# Altium schematic sheet MCU.SchDoc
size A4
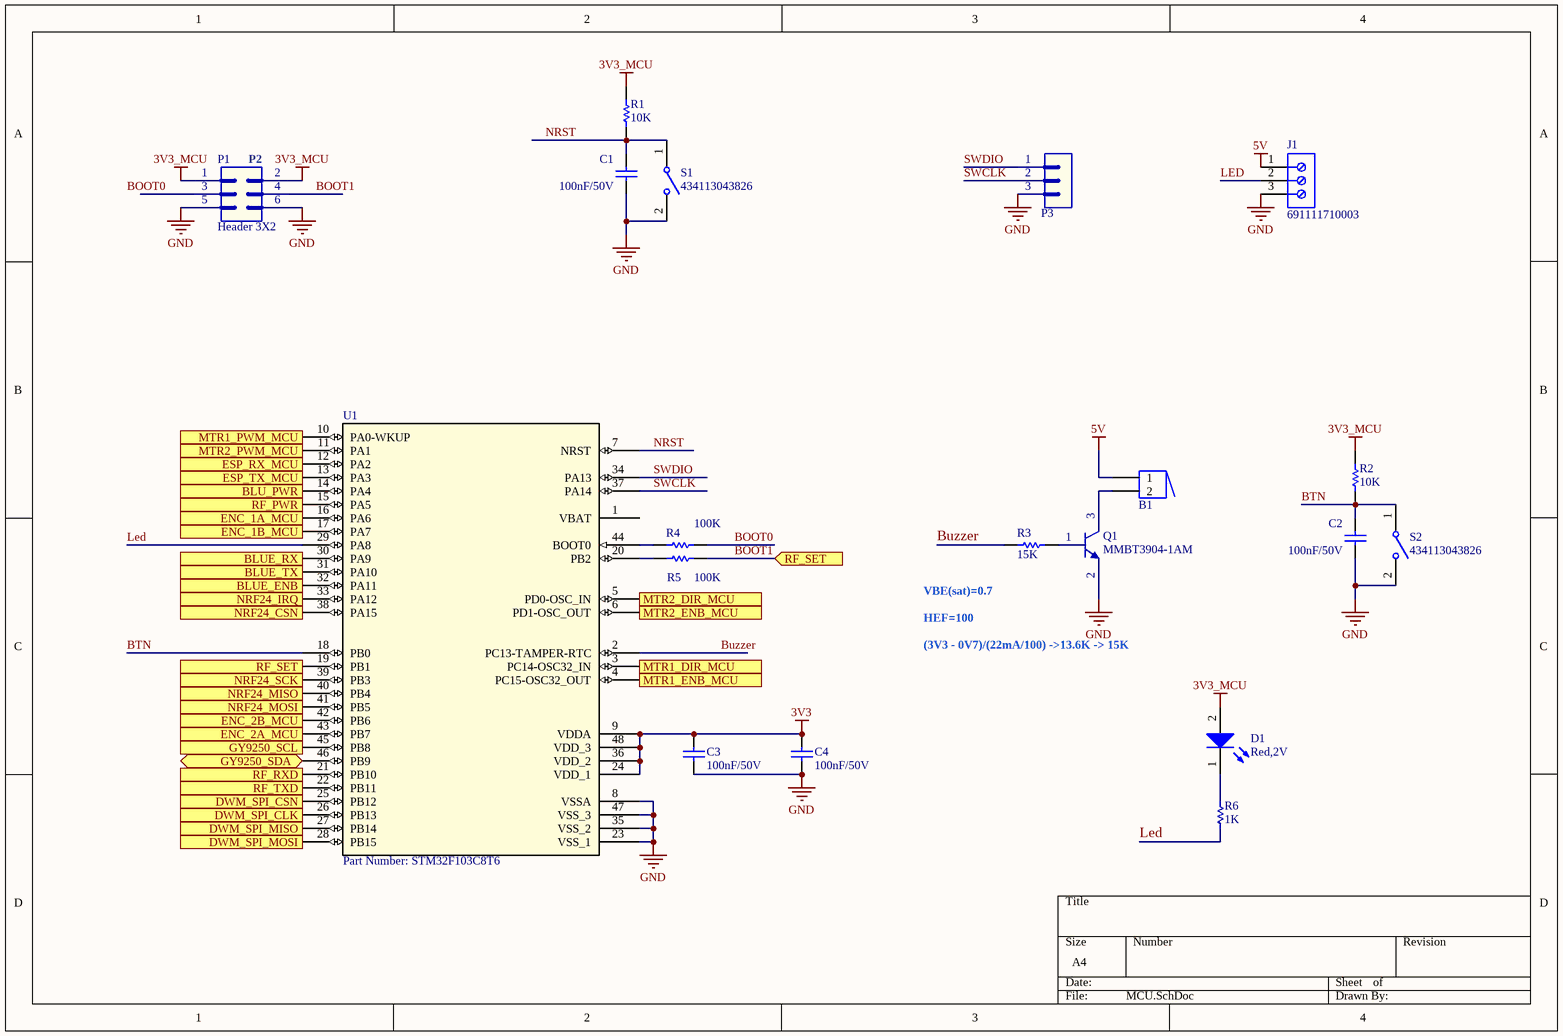
[diagram p0: MCU.SchDoc]

## Parts
B1  Buzzer  [BUZZER SMD]  (value not drawn)
C1  value 100nF/50V  [CAP-SM-0805]  (hidden comment: Cap-100nF-50V-0805)
C2  value 100nF/50V  [CAP-SM-0805]  (hidden comment: Cap-100nF-50V-0805)
C3  value 100nF/50V  [CAP-SM-0805]  (hidden comment: Cap-100nF-50V-0805)
C4  value 100nF/50V  [CAP-SM-0805]  (hidden comment: Cap-100nF-50V-0805)
D1  value Red,2V  [LED-3mm]  (hidden comment: LED-RED-TH-3mm)
J1  691111710003  [691111710003]
P1  Header 3X2  [JP3x2]
P3  Header 3  [JP3]  (value not drawn)
Q1  MMBT3904-1AM  [SOT23_NEX]
R1  value 10K  [RES-SM-0805]  (hidden comment: Res-10k-0805)
R2  value 10K  [RES-SM-0805]  (hidden comment: Res-10k-0805)
R3  value 15K  [RES-SM-0805]  (hidden comment: Res-15K-0805)
R4  value 100K  [RES-SM-0805]  (hidden comment: Res-100K-0805)
R5  value 100K  [RES-SM-0805]  (hidden comment: Res-100K-0805)
R6  value 1K  [RES 1/4W]  (hidden comment: Resistor 1/4W)
S1  434113043826  [434113043826]
S2  434113043826  [434113043826]
U1  Part Number: STM32F103C8T6  [LQFP-48]

## Ports
BLU_PWR (out), BLUE_ENB (out), BLUE_RX (out), BLUE_TX (in), DWM_SPI_CLK (out), DWM_SPI_CSN (out), DWM_SPI_MISO (in), DWM_SPI_MOSI (out), ENC_1A_MCU (in), ENC_1B_MCU (in), ENC_2A_MCU (in), ENC_2B_MCU (in), ESP_RX_MCU (out), ESP_TX_MCU (out), GY9250_SCL (out), GY9250_SDA (bidir), MTR1_DIR_MCU (out), MTR1_ENB_MCU (out), MTR1_PWM_MCU (out), MTR2_DIR_MCU (out), MTR2_ENB_MCU (out), MTR2_PWM_MCU, NRF24_CSN (out), NRF24_IRQ (in), NRF24_MISO (in), NRF24_MOSI (out), NRF24_SCK (out), RF_PWR, RF_RXD (out), RF_SET (in), RF_SET (out), RF_TXD (in)

## Nets
3V3: C3.2 C4.1 U1.9(VDDA) U1.24(VDD_1) U1.36(VDD_2) U1.48(VDD_3)
3V3_MCU: D1.2(K) P1.1 P1.2 R1.2 R2.2
5V: B1.1 J1.1
GND: C1.1 C2.1 C3.1 C4.2 J1.3 P1.5 P1.6 P3.3 Q1.2(E) S1.2 S2.2 U1.8(VSSA) U1.23(VSS_1) U1.35(VSS_2) U1.47(VSS_3)
BLU_PWR: U1.14(PA4) ; port BLU_PWR
BLUE_ENB: U1.32(PA11) ; port BLUE_ENB
BLUE_RX: U1.30(PA9) ; port BLUE_RX
BLUE_TX: U1.31(PA10) ; port BLUE_TX
BOOT0: R4.2
BOOT1: P1.4 R5.2 U1.19(PB1) ; port RF_SET
BTN: C2.2 R2.1 S2.1 U1.18(PB0)
Buzzer: R3.1 U1.2(PC13-TAMPER-RTC)
DWM_SPI_CLK: U1.26(PB13) ; port DWM_SPI_CLK
DWM_SPI_CSN: U1.25(PB12) ; port DWM_SPI_CSN
DWM_SPI_MISO: U1.27(PB14) ; port DWM_SPI_MISO
DWM_SPI_MOSI: U1.28(PB15) ; port DWM_SPI_MOSI
ENC_1A_MCU: U1.16(PA6) ; port ENC_1A_MCU
ENC_1B_MCU: U1.17(PA7) ; port ENC_1B_MCU
ENC_2A_MCU: U1.43(PB7) ; port ENC_2A_MCU
ENC_2B_MCU: U1.42(PB6) ; port ENC_2B_MCU
ESP_RX_MCU: U1.12(PA2) ; port ESP_RX_MCU
ESP_TX_MCU: U1.13(PA3) ; port ESP_TX_MCU
GY9250_SCL: U1.45(PB8) ; port GY9250_SCL
GY9250_SDA: U1.46(PB9) ; port GY9250_SDA
Led: J1.2 R6.2 U1.29(PA8)
MTR1_DIR_MCU: U1.3(PC14-OSC32_IN) ; port MTR1_DIR_MCU
MTR1_ENB_MCU: U1.4(PC15-OSC32_OUT) ; port MTR1_ENB_MCU
MTR1_PWM_MCU: U1.10(PA0-WKUP) ; port MTR1_PWM_MCU
MTR2_DIR_MCU: U1.5(PD0-OSC_IN) ; port MTR2_DIR_MCU
MTR2_ENB_MCU: U1.6(PD1-OSC_OUT) ; port MTR2_ENB_MCU
MTR2_PWM_MCU: U1.11(PA1) ; port MTR2_PWM_MCU
NRF24_CSN: U1.38(PA15) ; port NRF24_CSN
NRF24_IRQ: U1.33(PA12) ; port NRF24_IRQ
NRF24_MISO: U1.40(PB4) ; port NRF24_MISO
NRF24_MOSI: U1.41(PB5) ; port NRF24_MOSI
NRF24_SCK: U1.39(PB3) ; port NRF24_SCK
NRST: C1.2 R1.1 S1.1 U1.7(NRST)
RF_PWR: U1.15(PA5) ; port RF_PWR
RF_RXD: U1.21(PB10) ; port RF_RXD
RF_TXD: U1.22(PB11) ; port RF_TXD
SWCLK: P3.2 U1.37(PA14)
SWDIO: P3.1 U1.34(PA13)
NetB1_2: B1.2 Q1.3(C)
NetD1_1: D1.1(A) R6.1
NetQ1_1: Q1.1(B) R3.2
NetR4_1: R4.1 U1.44(BOOT0)
NetR5_1: R5.1 U1.20(PB2)

Not connected (* = marked no-connect by the designer): P1 3; U1 1(VBAT)

## Notes on the sheet
- Labels drawn without touching a wire or pin: (3V3 - 0V7)/(22mA/100) ->13.6K -> 15K, BOOT0, HEF=100, P2, VBE(sat)=0.7

## Library data of the parts
C1-C4 = Cap-100nF-50V-0805: CAP CER 0.1UF 50V Y5V 0805; Manufacturer: Samsung Electro-Mechanics; Manufacturer Part Number: CL21F104ZBCNNNC; Local Supplier: thegioiic; Local Supplier Link: https://thegioiic.com/products/tu-100nf-0-1uf-50v-0805; Supplier 1: Digikey; Supplier 1 Part Number: 1276-1007-1-ND; Supplier 1 Link: https://www.digikey.com/product-detail/en/samsung-electro-mechanics/CL21F104ZBCNNNC/1276-1007-1-ND/3889093
D1 = LED-RED-TH-3mm: LED RED CLEAR T-1 T/H; Manufacturer: Kingbright; Manufacturer Part Number: WP710A10SEC/J3; Local Supplier: thegioiic; Local Supplier Link: https://thegioiic.com/products/led-do-3mm-chan-dai; Supplier 1: Digikey; Supplier 1 Link: https://www.digikey.com/product-detail/en/kingbright/WP710A10SEC-J3/754-1589-ND/2769815; Supplier 1 Part Number: 754-1589-ND
J1 = 691111710003: WR-TBL Serie 111 Horizontal Entry Modular, Pressure Clamp, pitch 5mm, 3p; Compliance: Lead free / RoHS; Modularity: Yes; PCB/Cable/Panel: PCB; Pin Number: 3; Rated Current [UL]: 15A; Working Voltage [UL]: 250VAC; ComponentLink1Description: Manufacturer; ComponentLink1URL: http://www.we-online.de; ComponentLink2URL: https://katalog.we-online.de/em/datasheet/691111710003.pdf; ComponentLink2Description: Datasheet; Mounting Technology: THT; Part Number: 691111710003; Packaging: Box; Operating Temperature: -40 to +105degC; Pitch: 5mm; Published Date: October 2019; Type: Horizontal; Publisher: Wurth Elektronik; Application: Pressure Clamp
P1 = Header 3X2: Header, 3-Pin, Dual row; LatestRevisionDate: 17-Jul-2002; LatestRevisionNote: Re-released for DXP Platform.; Publisher: Altium Limited
P3 = Header 3: Header, 3-Pin; LatestRevisionDate: 17-Jul-2002; LatestRevisionNote: Re-released for DXP Platform.; Publisher: Altium Limited
R1 R2 = Res-10k-0805: RES 10K OHM 1% 1/4W 0805; Manufacturer: Stackpole Electronics Inc; Manufacturer Part Number: RNCP0805FTD10K0; Local Supplier: thegioiic; Local Supplier Link: https://thegioiic.com/products/dien-tro-10k-ohm-0805-5; Supplier 1: Digikey; Supplier 1 Link: https://www.digikey.com/product-detail/en/stackpole-electronics-inc/RNCP0805FTD10K0/RNCP0805FTD10K0CT-ND/2240601; Supplier 1 Part Number: RNCP0805FTD10K0CT-ND
R3 = Res-15K-0805: RES 15K OHM 1% 1/4W 0805; Manufacturer: TE Connectivity Passive Product; Manufacturer Part Number: CRGCQ0805F15K; Local Supplier: thegioiic; Local Supplier Link: https://thegioiic.com/products/dien-tro-15k-ohm-0805-1; Supplier 1: Digikey; Supplier 1 Part Number: A129763CT-ND; Supplier 1 Link: https://www.digikey.com/product-detail/en/te-connectivity-passive-product/CRGCQ0805F15K/A129763CT-ND/8577595
R4 R5 = Res-100K-0805: RES 0 OHM JUMPER 0805; Manufacturer: Vishay Dale; Manufacturer Part Number: WSL080500000ZEA9; Local Supplier: thegioiic; Local Supplier Link: https://thegioiic.com/products/dien-tro-0-ohm-0805-5; Supplier 1: Digikey; Supplier 1 Link: https://www.digikey.com/product-detail/en/vishay-dale/WSL080500000ZEA9/541-3928-1-ND/7423223; Supplier 1 Part Number: 541-3928-1-ND
R6 = Res
S1 S2 = 434113043826: WS-TASV J-Bend SMT Tact Switch 6x3.5mm, height 4.3mm, 260gf; Rated Voltage: 12VDC; Rated Current: 50mA; Washable: No; ComponentLink1Description: Manufacturer; ComponentLink1URL: http://www.we-online.de; ComponentLink2Description: Datasheet; ComponentLink2URL: https://katalog.we-online.com/em/datasheet/434113043826.pdf; Operating Temperature: -40 to +85degC; Part Number: 434113043826; Published Date: September 2019; Contact Material: Stainless Steel; Height: 4.3mm; Mounting Technology: SMT; Contact Plating: Silver; Operation Force: 260gf; Packaging: Tape and Reel; Terminal Material: Copper Alloy; Publisher: Wurth Elektronik; Terminal Plating: Silver
U1 = STM32F103C8T6: No Description Available; Vendor: STMicroelectronics; Built_By: EMA_UL_Team; Manufacturer_Part_Number: STM32F103C8T6; Copyright: Copyright (C) 2018 Accelerated Designs. All rights reserved; RefDes: RefDes; Type: DEV; Value: Value